# Altium schematic sheet [6] - COMMUNICATIONS.SchDoc: Control Board
size A4; CheckedBy: Rafael Lang; CompanyName: Gear Labs; DrawnBy: Pedro Neves; Organization: Gear Labs; DocumentNumber: 001/2017; Revision: v1.0; SheetNumber: 6; SheetTotal: 6
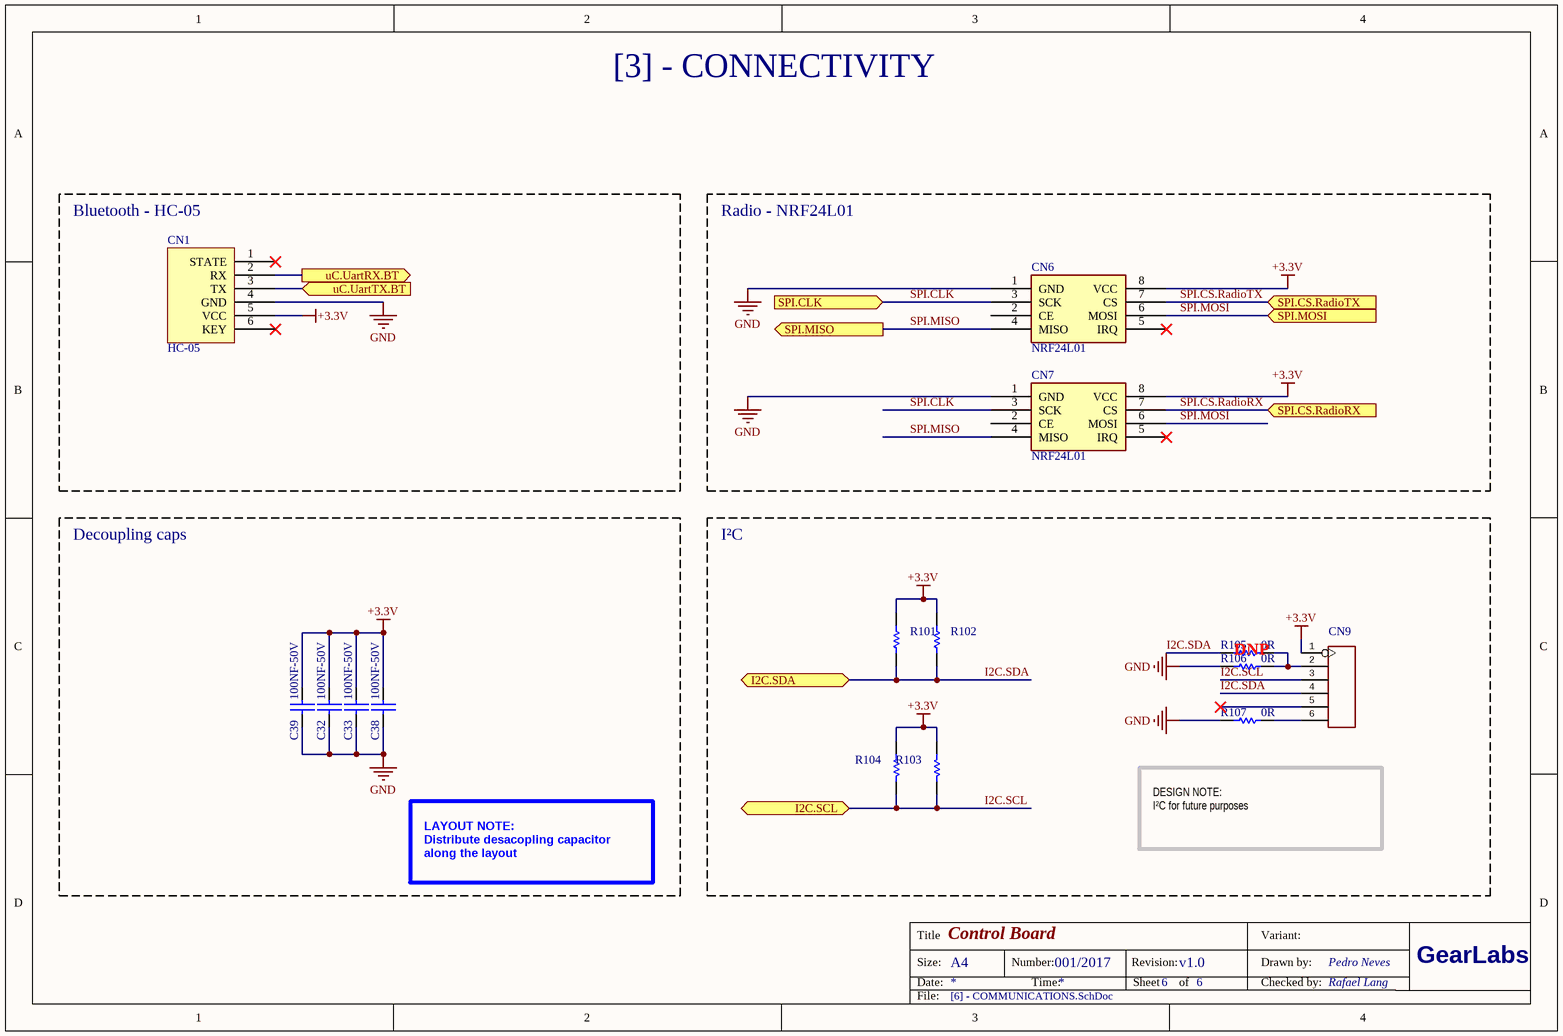
[diagram p0: [6] - COMMUNICATIONS.SchDoc]

## Parts
C32  value 100NF-50V  [C0603]  (hidden comment: 302010138)
C33  value 100NF-50V  [C0603]  (hidden comment: 302010138)
C38  value 100NF-50V  [C0603]  (hidden comment: 302010138)
C39  value 100NF-50V  [C0603]  (hidden comment: 302010138)
CN1  HC-05  [HC-05]
CN6  NRF24L01  [NRF24l01]
CN7  NRF24L01  [NRF24l01]
CN9  320030060  [H6-2.54]  (value not drawn)
R101  301010299  [R0603]  (value not drawn)
R102  301010299  [R0603]  (value not drawn)
R103  301010299  [R0603]  (value not drawn)
R104  301010299  [R0603]  (value not drawn)
R105  value 0R  [R0603]  (hidden comment: 301010292)
R106  value 0R  [R0603]  (hidden comment: 301010292)
R107  value 0R  [R0603]  (hidden comment: 301010292)

## Blocks framed on the sheet
Bluetooth - HC-05: CN1
Radio - NRF24L01: CN6 CN7
Decoupling caps: C32 C33 C38 C39

## Ports
I2C.SCL (bidir), I2C.SDA (bidir), SPI.CLK (in), SPI.CS.RadioRX (in), SPI.CS.RadioTX (in), SPI.MISO (out), SPI.MOSI (in), uC.UartRX.BT (out), uC.UartTX.BT (in)

## Nets
+3.3V: C32.1 C33.1 C38.1 C39.1 CN1.5(VCC) CN6.8(VCC) CN7.8(VCC) CN9.1 R101.2 R102.2 R103.2 R104.2
GND: C32.2 C33.2 C38.2 C39.2 CN1.4(GND) CN6.1(GND) CN7.1(GND) R106.1 R107.1
I2C.SCL: CN9.3 R103.1 R104.1 ; port I2C.SCL
I2C.SDA: CN9.4 R101.1 R102.1 R105.1 ; port I2C.SDA
SPI.CLK: CN6.3(SCK) CN7.3(SCK) ; port SPI.CLK
SPI.CS.RadioRX: CN7.7(CS) ; port SPI.CS.RadioRX
SPI.CS.RadioTX: CN6.7(CS) ; port SPI.CS.RadioTX
SPI.MISO: CN6.4(MISO) CN7.4(MISO) ; port SPI.MISO
SPI.MOSI: CN6.6(MOSI) CN7.6(MOSI) ; port SPI.MOSI
uC.UartRX.BT: CN1.2(RX) ; port uC.UartRX.BT
uC.UartTX.BT: CN1.3(TX) ; port uC.UartTX.BT
NetCN9_2: CN9.2 R105.2 R106.2
NetCN9_6: CN9.6 R107.2

Not connected (* = marked no-connect by the designer): CN1 1(STATE)* 6(KEY)*; CN6 2(CE) 5(IRQ)*; CN7 2(CE) 5(IRQ)*; CN9 5*

## Notes on the sheet
- [3] - CONNECTIVITY
- I²C
- (near R105) DNP
- DESIGN NOTE:
  I²C for future purposes
- LAYOUT NOTE:
  Distribute desacopling capacitor along the layout
- Title
- Size:
- Date:
- A4
- Number:
- Time:
- Revision:
- Sheet
- of
- Drawn by:
- Checked by:
- Variant:
- GearLabs
- File:

## Library data of the parts
C32 C33 C38 C39 = CERAMIC-100NF-50V-10%-X7R(0603): MPN: CC0603KRX7R9BB104
CN9 = DIP-BLACK-FEMALE-HEADER-VERT(6P-2.54): MPN: F185-1106A1BSYC1
R101-R104 = SMD-RES-10K-1%-1/10W(0603): MPN: RC0603FR-0710KL
R105-R107 = SMD-RES-0R-5%-1/10W(0603): MPN: RC0603JR-070RL
CN1 = HC-05: value: HC-05
CN6 CN7 = NRF24L01: value: NRF24L01